# Altium schematic sheet RemoteShutter2.SchDoc: Remote Mobile Camera Shutter
size A4; DrawnBy: Deependra Dewagiri; Engineer: Deependra Dewagiri; Organization: Deependra Dewagiri; Revision: 3; SheetNumber: 1; SheetTotal: 3; SPICEModelCacheFSRUGMAC: <root> / <DocumentId>FSRUGMAC</DocumentId> / </root>
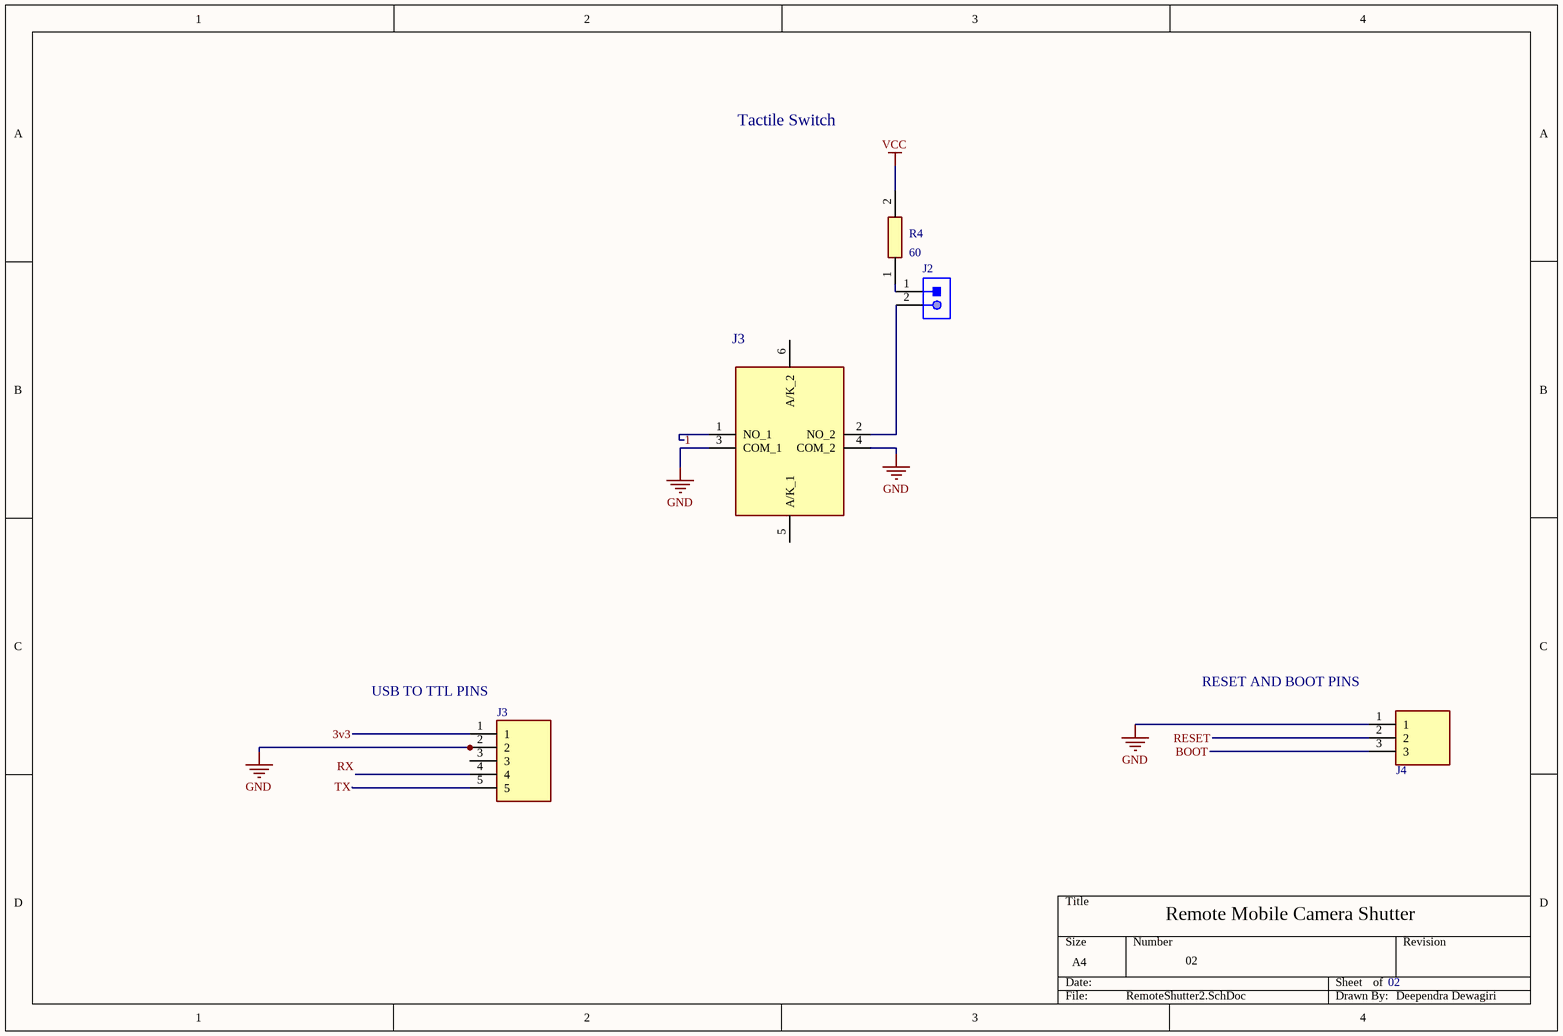
[diagram p0: RemoteShutter2.SchDoc]

## Parts
(Parts that share a designator on the sheet are numbered #1, #2 ... from top to bottom, then left to right.)
J2  61300211121  [61300211121]  (value not drawn)
J3#1  TLL-62BG-S-V-B  [TLL62BGSVB]  (value not drawn)
J3#2  801-87-005-20-002101  [RHDRRA5W62P0X254_1X5_1270X295X254P]  (value not drawn)
J4  68016-403HLF  [HDRRA3W67P0X254_1X3_762X254X241P]  (value not drawn)
R4  60  [RESC3216X60N]

## Nets
GND: J3#1.3(COM_1) J3#1.4(COM_2) J3#2.2 J4.1
VCC: R4.2
1: J3#1.1(NO_1)
3v3: J3#2.1
BOOT: J4.3
RESET: J4.2
RX: J3#2.4
TX: J3#2.5
NetJ2_1: J2.1 R4.1
NetJ2_2: J2.2 J3#1.2(NO_2)

Not connected (* = marked no-connect by the designer): J3#1 5(A/K_1) 6(A/K_2); J3#2 3

## Notes on the sheet
- Tactile Switch
- (near J3#2) USB TO TTL PINS
- RESET AND BOOT PINS
- Remote Mobile Camera Shutter
- 02
- Deependra Dewagiri

## Library data of the parts
J2 = CMP-1712-00002-4: THT Vertical Pin Header WR-PHD, Pitch 2.54 mm, Single Row, 2 pins; Manufacturer: Wurth Elektronik; Rated Current: 3A; Gender: Male; Withstanding Voltage: 500VAC; Working Voltage: 250VAC; Pitch: 2.54mm; Contact Resistance: 20mOhm; Pin Number: 2; Mounting Technology: THT; Orientation: Vertical; Operating Temperature: -40to105degC; Packaging: Bag; Publisher: WurthElektronik; Datasheet URL: https://katalog.we-online.de/em/datasheet/6130xx11121.pdf; Manufacturer URL: http://www.we-online.de; Row Number: Single; Package Reference: 61300211121; Part Number: 61300211121
J3#1 = CMP-010-000000-1: Tactile Switches Through Hole 6.1*6.1 (LED Color); Manufacturer_Name: Diptronics; Geometry.Height: 7mm; Mouser Price/Stock: https://www.mouser.co.uk/ProductDetail/Diptronics/TLL-62BG-S-V-B?qs=gTYE2QTfZfQEDhaDh6DnIQ%3D%3D; Datasheet Link: *; Manufacturer_Part_Number: TLL-62BG-S-V-B; Design Item ID: TLL-62BG-S-V-B; Mouser Part Number: 113-TLL-62BG-S-V-B; Source: TLL-62BG-S-V-B.SchLib
J3#2 = 801-87-005-20-002101: Connector; Manufacturer_Name: Preci-Dip; Datasheet Link: https://www.precidip.com/AppHost/9696,1/Scripts/Modules/Catalog/Default.aspx?c=7&i=219&p=86&pdf=1&dsku=801-PP-NNN-20-002101; Height: 2.54mm; Manufacturer_Part_Number: 801-87-005-20-002101; Mouser Part Number: 437-8018700520002101; Mouser Price/Stock: https://www.mouser.co.uk/ProductDetail/Preci-dip/801-87-005-20-002101?qs=q5BRkYolQ3je8P8riDHomg%3D%3D
J4 = 68016-403HLF: Connector; Manufacturer_Name: Amphenol Communications Solutions; Datasheet Link: https://cdn.amphenol-cs.com/media/wysiwyg/files/drawing/68015.pdf; Height: 2.41mm; Manufacturer_Part_Number: 68016-403HLF; Mouser Part Number: 649-68016-403HLF; Mouser Price/Stock: https://www.mouser.co.uk/ProductDetail/Amphenol-FCI/68016-403HLF?qs=osVJq4lsVJcI0%252Bykiqpb0w%3D%3D; Arrow Part Number: 68016-403HLF; Arrow Price/Stock: https://www.arrow.com/en/products/68016-403hlf/amphenol-fci?region=nac
R4 = CRCW120660R0KNEAIF: Resistor; Manufacturer_Name: Vishay; Datasheet Link: http://componentsearchengine.com/Datasheets/1/CRCW120660R0KNEAIF.pdf; Height: 0.6mm; Manufacturer_Part_Number: CRCW120660R0KNEAIF; Mouser Part Number: 71-CRCW120660R0KNAIF; Mouser Price/Stock: https://www.mouser.co.uk/ProductDetail/Vishay-Dale/CRCW120660R0KNEAIF?qs=0LP1uVfdam9gTU37MuGrNg%3D%3D